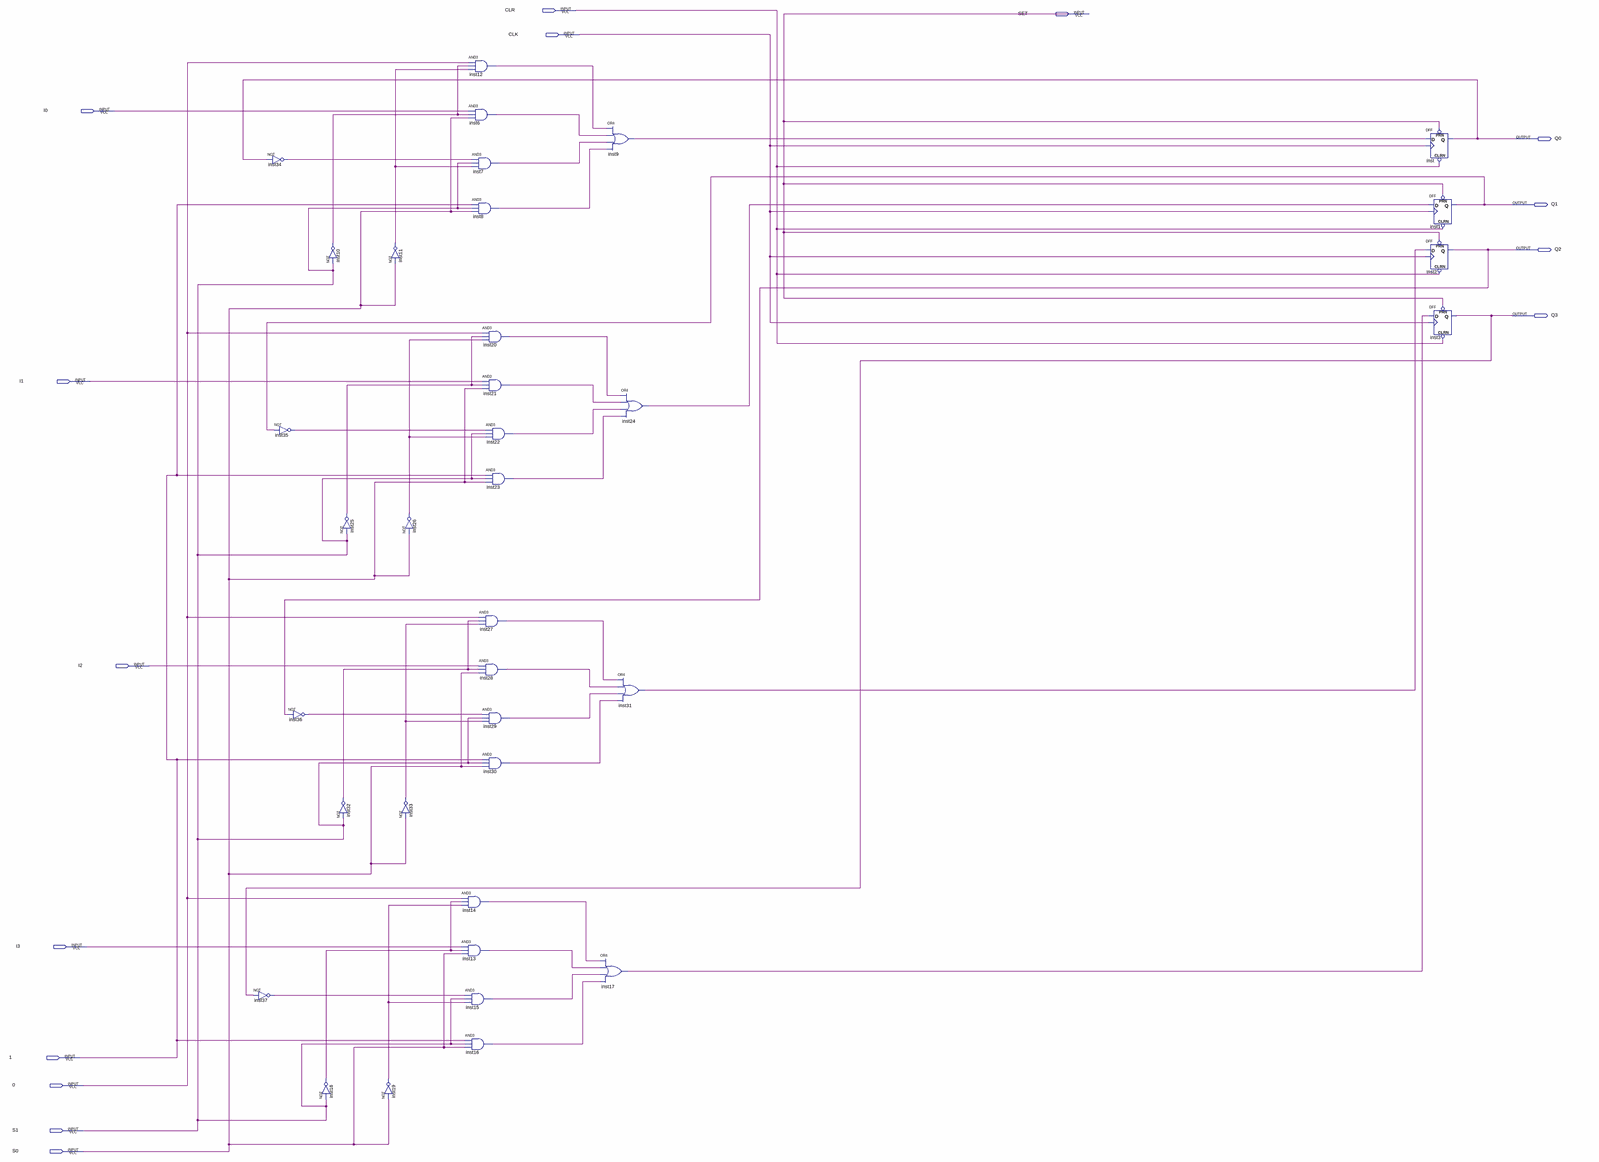
[diagram p0: schematic sheet, whole]
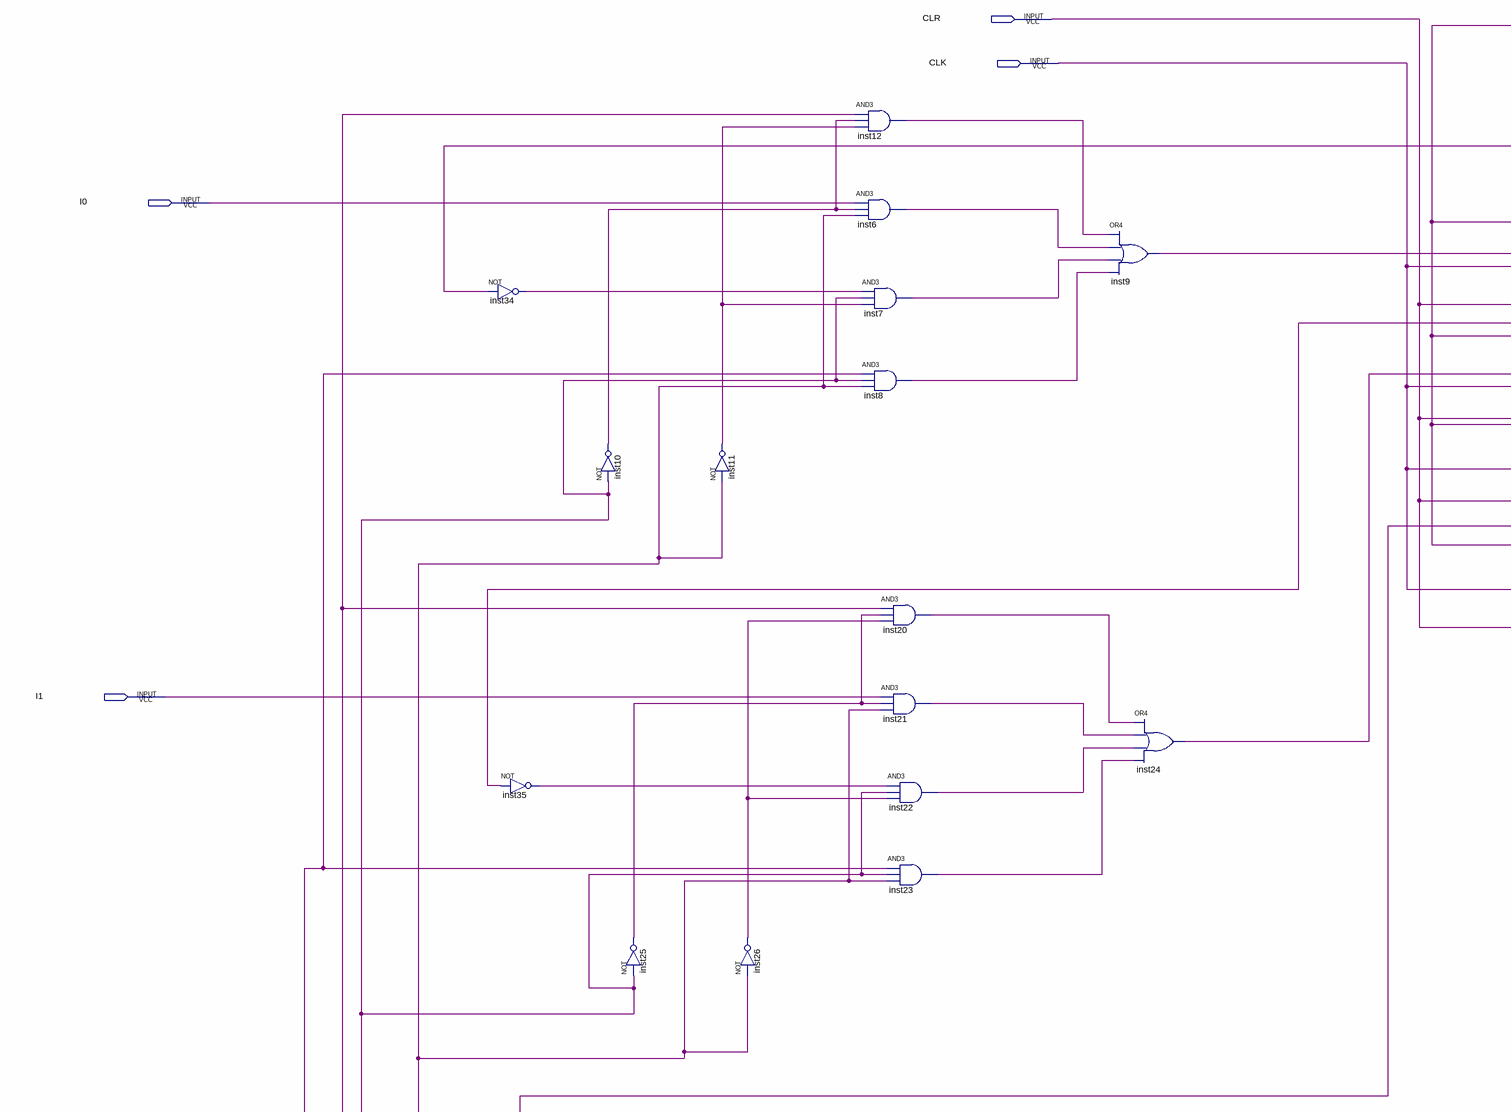
[diagram p1: schematic sheet, upper left part]
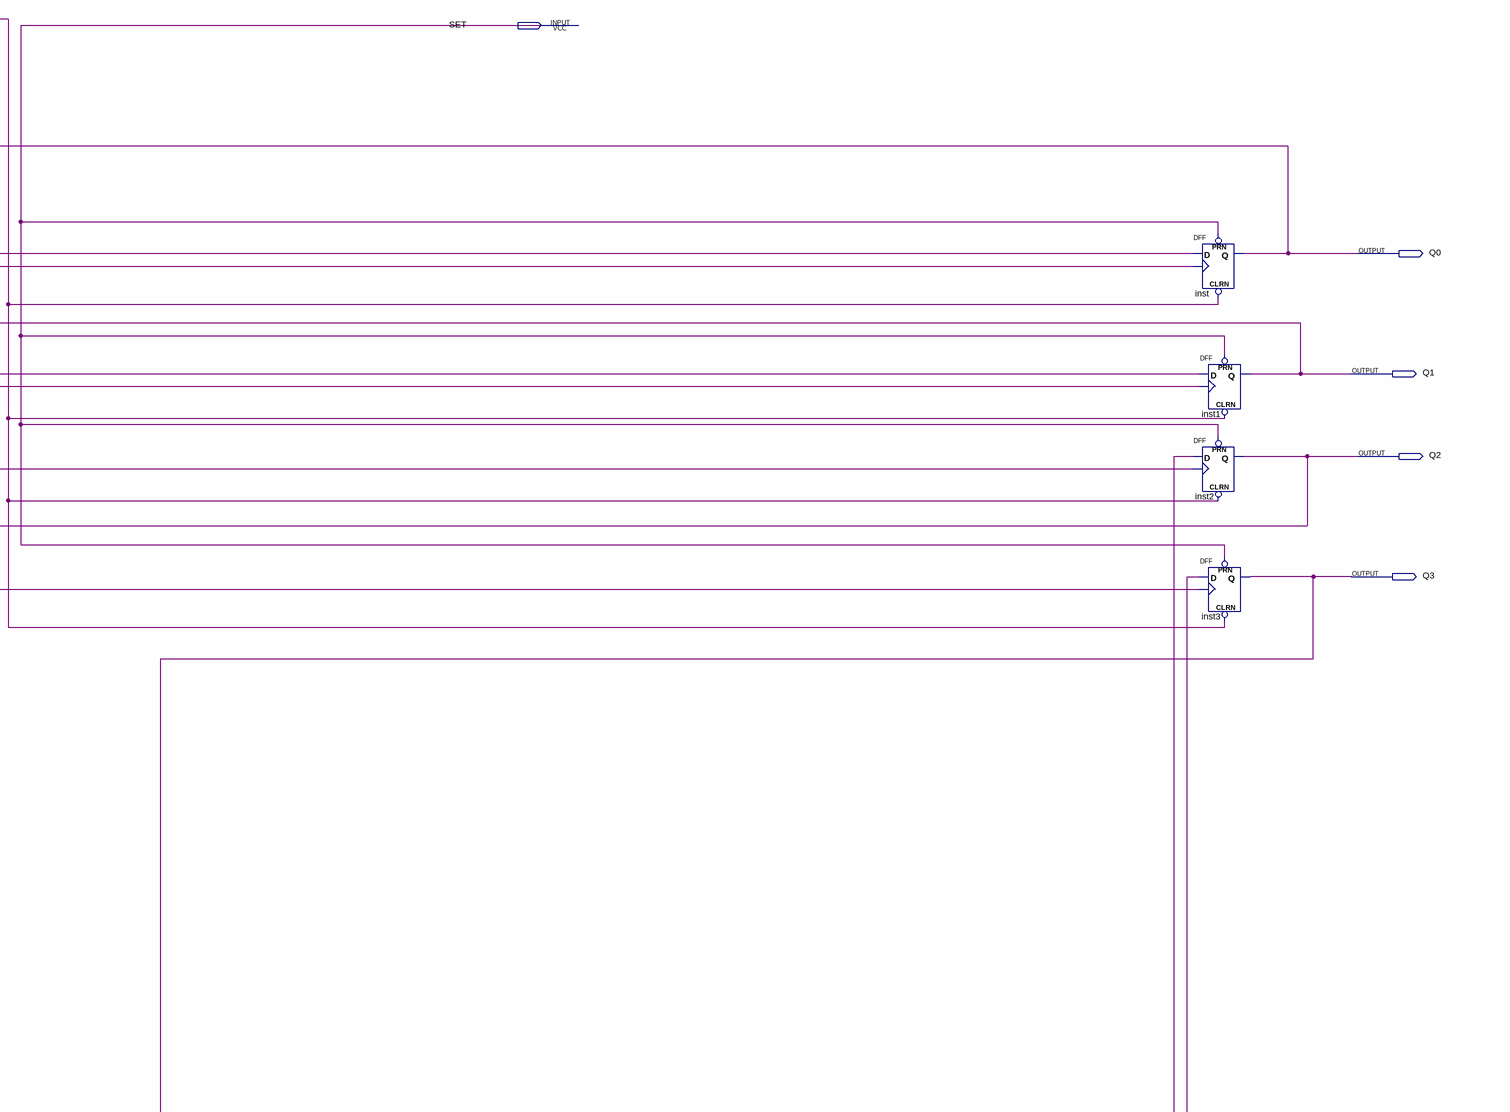
[diagram p2: schematic sheet, upper right part]
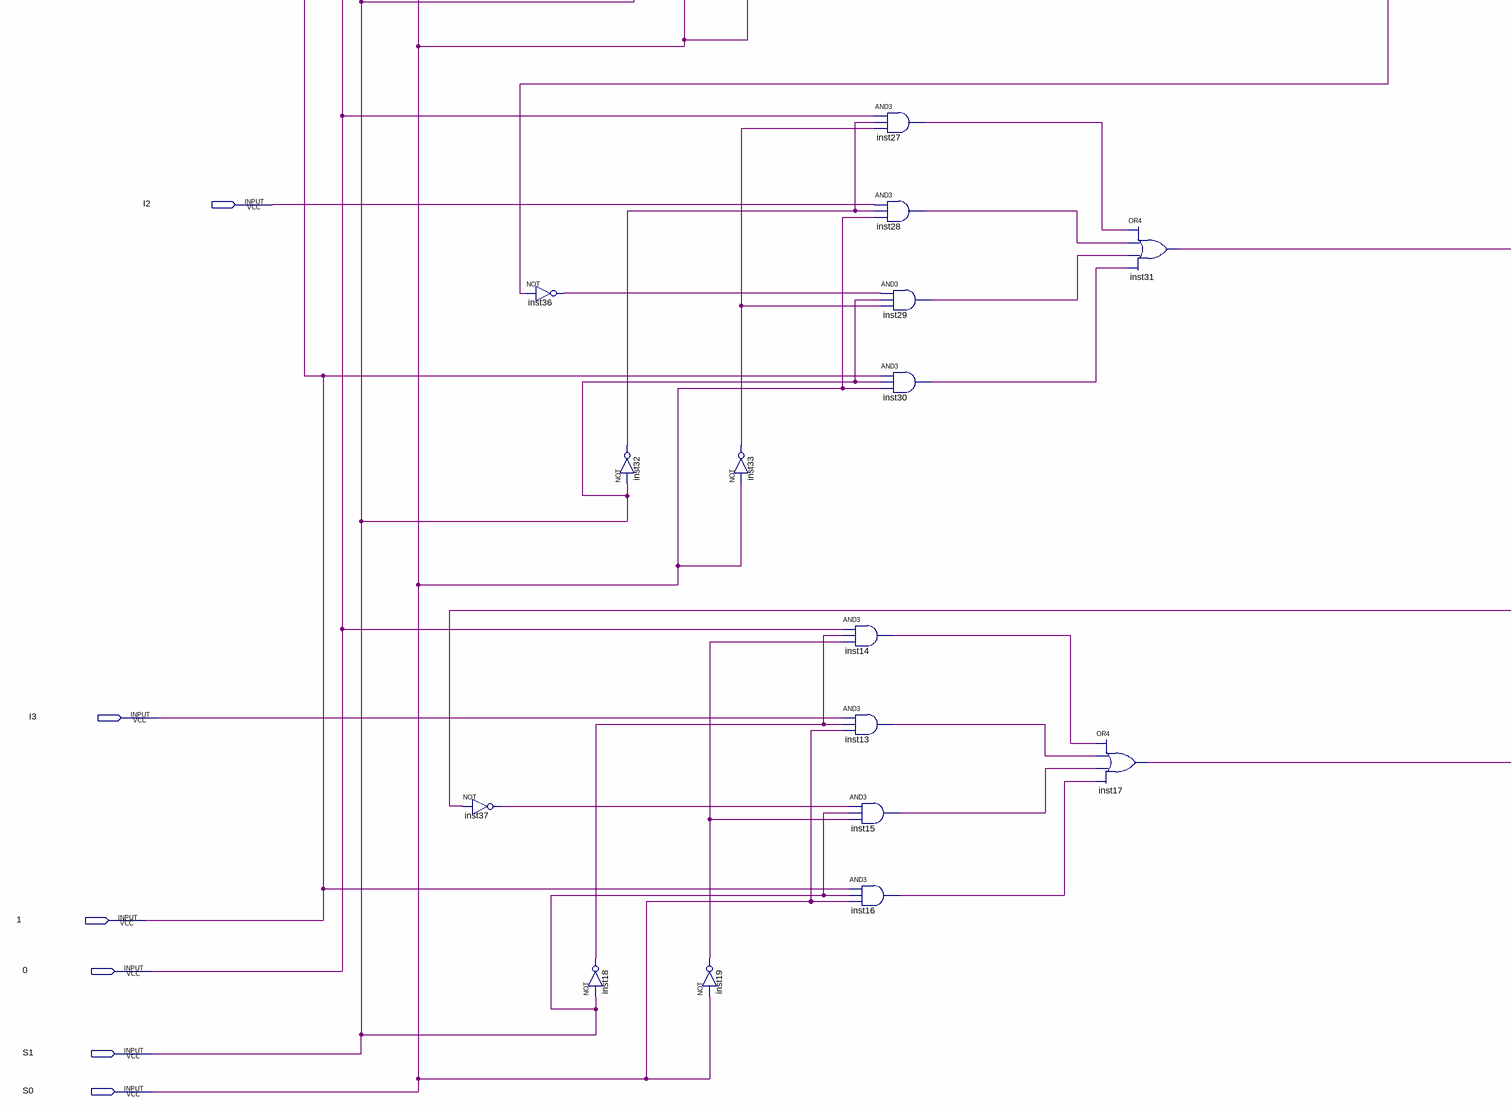
[diagram p3: schematic sheet, lower left part]
// Quartus schematic Register.bdf as structural Verilog: 36 symbols, 15 pins
module Register (
  input  CLR,
  input  SET,
  input  CLK,
  input  I0,
  input  I1,
  input  I2,
  input  I3,
  input  \1 ,
  input  \0 ,
  input  S1,
  input  S0,
  output Q0,
  output Q1,
  output Q2,
  output Q3
);

  wire inst6_out, inst7_out, inst8_out, inst9_out, inst10_out, inst11_out, inst12_out, inst13_out,
       inst14_out, inst15_out, inst16_out, inst17_out, inst18_out, inst19_out, inst20_out, inst21_out,
       inst22_out, inst23_out, inst24_out, inst25_out, inst26_out, inst27_out, inst28_out, inst29_out,
       inst30_out, inst31_out, inst32_out, inst33_out, inst34_out, inst35_out, inst36_out, inst37_out;

  not inst34 (inst34_out, Q0);
  not inst37 (inst37_out, Q3);
  not inst35 (inst35_out, Q1);
  not inst36 (inst36_out, Q2);
  not inst18 (inst18_out, S1);
  not inst10 (inst10_out, S1);
  not inst25 (inst25_out, S1);
  not inst32 (inst32_out, S1);
  not inst11 (inst11_out, S0);
  not inst26 (inst26_out, S0);
  not inst33 (inst33_out, S0);
  not inst19 (inst19_out, S0);
  and inst14 (inst14_out, \0 , inst18_out, inst19_out);
  and inst13 (inst13_out, I3, inst18_out, S0);
  and inst12 (inst12_out, \0 , inst10_out, inst11_out);
  and inst6 (inst6_out, I0, inst10_out, S0);
  and inst7 (inst7_out, inst34_out, S1, inst11_out);
  and inst8 (inst8_out, \1 , S1, S0);
  and inst20 (inst20_out, \0 , inst25_out, inst26_out);
  and inst21 (inst21_out, I1, inst25_out, S0);
  and inst22 (inst22_out, inst35_out, S1, inst26_out);
  and inst23 (inst23_out, \1 , S1, S0);
  and inst27 (inst27_out, \0 , inst32_out, inst33_out);
  and inst28 (inst28_out, I2, inst32_out, S0);
  and inst29 (inst29_out, inst36_out, S1, inst33_out);
  and inst30 (inst30_out, \1 , S1, S0);
  and inst15 (inst15_out, inst37_out, S1, inst19_out);
  and inst16 (inst16_out, \1 , S1, S0);
  or inst17 (inst17_out, inst14_out, inst13_out, inst15_out, inst16_out);
  or inst9 (inst9_out, inst12_out, inst6_out, inst7_out, inst8_out);
  or inst24 (inst24_out, inst20_out, inst21_out, inst22_out, inst23_out);
  or inst31 (inst31_out, inst27_out, inst28_out, inst29_out, inst30_out);
  DFF inst (.CLRN(CLR), .CLK(CLK), .D(inst9_out), .PRN(SET), .Q(Q0));
  DFF inst1 (.CLRN(CLR), .CLK(CLK), .D(inst24_out), .PRN(SET), .Q(Q1));
  DFF inst2 (.CLRN(CLR), .CLK(CLK), .D(inst31_out), .PRN(SET), .Q(Q2));
  DFF inst3 (.CLRN(CLR), .CLK(CLK), .D(inst17_out), .PRN(SET), .Q(Q3));
endmodule
